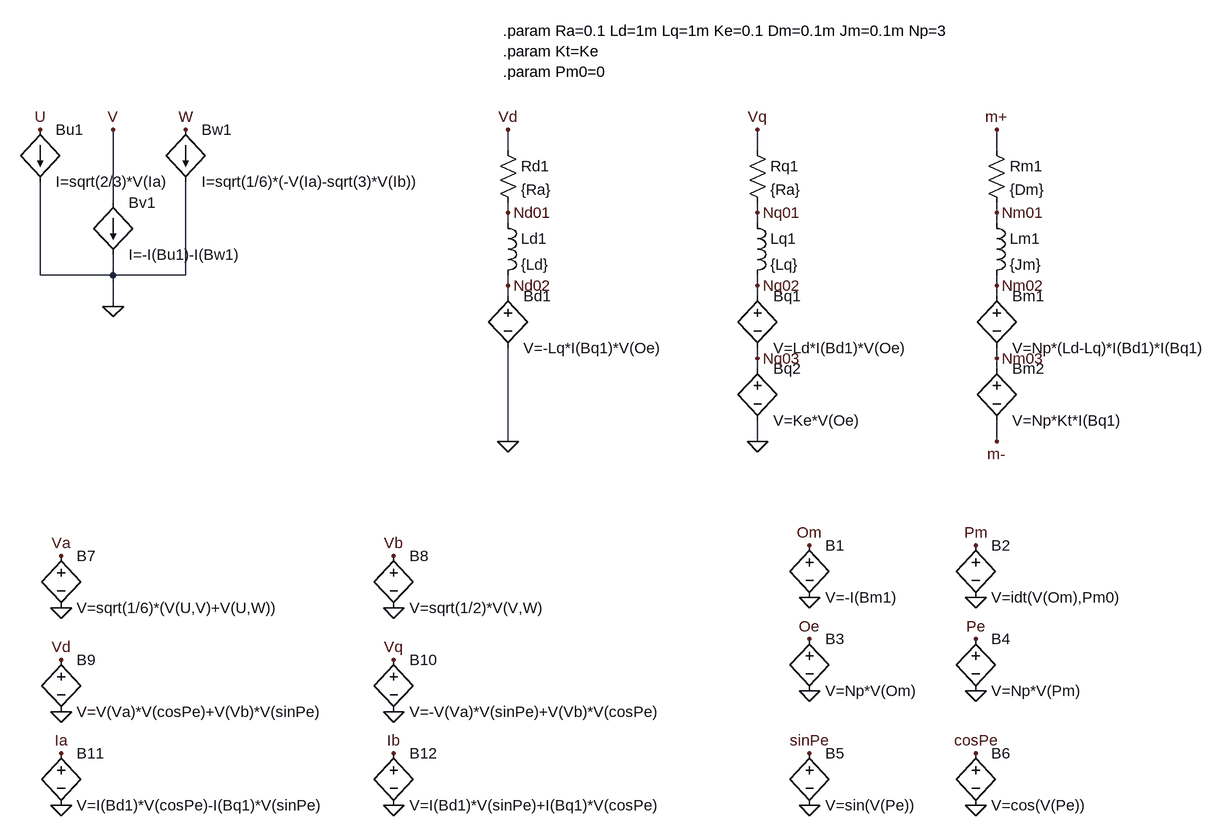
[diagram p0: schematic PMSMotorInternalModel.asc]
PMSMotorInternalModel.asc, the LTspice schematic file:
Version 4
SHEET 1 2028 1044
WIRE 832 -1008 832 -1040
WIRE 1216 -1008 1216 -1040
WIRE 1584 -1008 1584 -1040
WIRE 224 -928 224 -1040
WIRE 832 -912 832 -928
WIRE 1216 -912 1216 -928
WIRE 1584 -912 1584 -928
WIRE 832 -896 832 -912
WIRE 1216 -896 1216 -912
WIRE 1584 -896 1584 -912
WIRE 112 -816 112 -960
WIRE 224 -816 224 -848
WIRE 224 -816 112 -816
WIRE 336 -816 336 -960
WIRE 336 -816 224 -816
WIRE 832 -800 832 -816
WIRE 1216 -800 1216 -816
WIRE 1584 -800 1584 -816
WIRE 832 -784 832 -800
WIRE 1216 -784 1216 -800
WIRE 1584 -784 1584 -800
WIRE 224 -768 224 -816
WIRE 1216 -688 1216 -704
WIRE 1584 -688 1584 -704
WIRE 1216 -672 1216 -688
WIRE 1584 -672 1584 -688
WIRE 832 -560 832 -704
WIRE 1216 -560 1216 -592
WIRE 1584 -560 1584 -592
FLAG 112 -1040 U
FLAG 224 -1040 V
FLAG 336 -1040 W
FLAG 224 -768 0
FLAG 832 -1040 Vd
FLAG 832 -560 0
FLAG 1216 -1040 Vq
FLAG 1216 -560 0
FLAG 1584 -1040 m+
FLAG 1584 -560 m-
FLAG 144 -384 Va
FLAG 144 -304 0
FLAG 656 -384 Vb
FLAG 656 -304 0
FLAG 144 -224 Vd
FLAG 144 -144 0
FLAG 656 -224 Vq
FLAG 656 -144 0
FLAG 144 -80 Ia
FLAG 144 0 0
FLAG 656 -80 Ib
FLAG 656 0 0
FLAG 1296 -400 Om
FLAG 1296 -320 0
FLAG 1552 -400 Pm
FLAG 1552 -320 0
FLAG 1296 -256 Oe
FLAG 1296 -176 0
FLAG 1552 -256 Pe
FLAG 1552 -176 0
FLAG 1296 -80 sinPe
FLAG 1296 0 0
FLAG 1552 -80 cosPe
FLAG 1552 0 0
FLAG 832 -912 Nd01
FLAG 832 -800 Nd02
FLAG 1216 -912 Nq01
FLAG 1216 -800 Nq02
FLAG 1216 -688 Nq03
FLAG 1584 -912 Nm01
FLAG 1584 -800 Nm02
FLAG 1584 -688 Nm03
SYMBOL res 816 -1024 R0
SYMATTR InstName Rd1
SYMATTR Value {Ra}
SYMBOL ind 816 -912 R0
SYMATTR InstName Ld1
SYMATTR Value {Ld}
SYMATTR SpiceLine Rser=0
SYMBOL bv 832 -800 R0
SYMATTR InstName Bd1
SYMATTR Value V=-Lq*I(Bq1)*V(Oe)
SYMBOL res 1200 -1024 R0
SYMATTR InstName Rq1
SYMATTR Value {Ra}
SYMBOL ind 1200 -912 R0
SYMATTR InstName Lq1
SYMATTR Value {Lq}
SYMATTR SpiceLine Rser=0
SYMBOL bv 1216 -800 R0
SYMATTR InstName Bq1
SYMATTR Value V=Ld*I(Bd1)*V(Oe)
SYMBOL bv 1216 -688 R0
SYMATTR InstName Bq2
SYMATTR Value V=Ke*V(Oe)
SYMBOL res 1568 -1024 R0
SYMATTR InstName Rm1
SYMATTR Value {Dm}
SYMBOL ind 1568 -912 R0
SYMATTR InstName Lm1
SYMATTR Value {Jm}
SYMATTR SpiceLine Rser=0
SYMBOL bv 1584 -800 R0
SYMATTR InstName Bm1
SYMATTR Value V=Np*(Ld-Lq)*I(Bd1)*I(Bq1)
SYMBOL bv 1584 -688 R0
SYMATTR InstName Bm2
SYMATTR Value V=Np*Kt*I(Bq1)
SYMBOL bi 112 -1040 R0
SYMATTR InstName Bu1
SYMATTR Value I=sqrt(2/3)*V(Ia)
SYMBOL bi 224 -928 R0
SYMATTR InstName Bv1
SYMATTR Value I=-I(Bu1)-I(Bw1)
SYMBOL bi 336 -1040 R0
SYMATTR InstName Bw1
SYMATTR Value I=sqrt(1/6)*(-V(Ia)-sqrt(3)*V(Ib))
SYMBOL bv 1296 -416 R0
SYMATTR InstName B1
SYMATTR Value V=-I(Bm1)
SYMBOL bv 1552 -416 R0
SYMATTR InstName B2
SYMATTR Value V=idt(V(Om),Pm0)
SYMBOL bv 1296 -272 R0
SYMATTR InstName B3
SYMATTR Value V=Np*V(Om)
SYMBOL bv 1552 -272 R0
SYMATTR InstName B4
SYMATTR Value V=Np*V(Pm)
SYMBOL bv 1296 -96 R0
SYMATTR InstName B5
SYMATTR Value V=sin(V(Pe))
SYMBOL bv 1552 -96 R0
SYMATTR InstName B6
SYMATTR Value V=cos(V(Pe))
SYMBOL bv 144 -400 R0
SYMATTR InstName B7
SYMATTR Value V=sqrt(1/6)*(V(U,V)+V(U,W))
SYMBOL bv 656 -400 R0
SYMATTR InstName B8
SYMATTR Value V=sqrt(1/2)*V(V,W)
SYMBOL bv 144 -240 R0
SYMATTR InstName B9
SYMATTR Value V=V(Va)*V(cosPe)+V(Vb)*V(sinPe)
SYMBOL bv 656 -240 R0
SYMATTR InstName B10
SYMATTR Value V=-V(Va)*V(sinPe)+V(Vb)*V(cosPe)
SYMBOL bv 144 -96 R0
SYMATTR InstName B11
SYMATTR Value V=I(Bd1)*V(cosPe)-I(Bq1)*V(sinPe)
SYMBOL bv 656 -96 R0
SYMATTR InstName B12
SYMATTR Value V=I(Bd1)*V(sinPe)+I(Bq1)*V(cosPe)
TEXT 824 -1192 Left 2 !.param Ra=0.1 Ld=1m Lq=1m Ke=0.1 Dm=0.1m Jm=0.1m Np=3\n.param Kt=Ke\n.param Pm0=0

The netlist it stands for:
* PMSMotorInternalModel.asc
Rd1 Vd Nd01 {Ra}
Ld1 Nd01 Nd02 {Ld} Rser=0
Bd1 Nd02 0 V=-Lq*I(Bq1)*V(Oe)
Rq1 Vq Nq01 {Ra}
Lq1 Nq01 Nq02 {Lq} Rser=0
Bq1 Nq02 Nq03 V=Ld*I(Bd1)*V(Oe)
Bq2 Nq03 0 V=Ke*V(Oe)
Rm1 m+ Nm01 {Dm}
Lm1 Nm01 Nm02 {Jm} Rser=0
Bm1 Nm02 Nm03 V=Np*(Ld-Lq)*I(Bd1)*I(Bq1)
Bm2 Nm03 m- V=Np*Kt*I(Bq1)
Bu1 U 0 I=sqrt(2/3)*V(Ia)
Bv1 V 0 I=-I(Bu1)-I(Bw1)
Bw1 W 0 I=sqrt(1/6)*(-V(Ia)-sqrt(3)*V(Ib))
B1 Om 0 V=-I(Bm1)
B2 Pm 0 V=idt(V(Om),Pm0)
B3 Oe 0 V=Np*V(Om)
B4 Pe 0 V=Np*V(Pm)
B5 sinPe 0 V=sin(V(Pe))
B6 cosPe 0 V=cos(V(Pe))
B7 Va 0 V=sqrt(1/6)*(V(U,V)+V(U,W))
B8 Vb 0 V=sqrt(1/2)*V(V,W)
B9 Vd 0 V=V(Va)*V(cosPe)+V(Vb)*V(sinPe)
B10 Vq 0 V=-V(Va)*V(sinPe)+V(Vb)*V(cosPe)
B11 Ia 0 V=I(Bd1)*V(cosPe)-I(Bq1)*V(sinPe)
B12 Ib 0 V=I(Bd1)*V(sinPe)+I(Bq1)*V(cosPe)
.param Ra=0.1 Ld=1m Lq=1m Ke=0.1 Dm=0.1m Jm=0.1m Np=3
.param Kt=Ke
.param Pm0=0
.backanno
.end